# EAGLE schematic chargerboardrev2 (EAGLE 9.4.2)
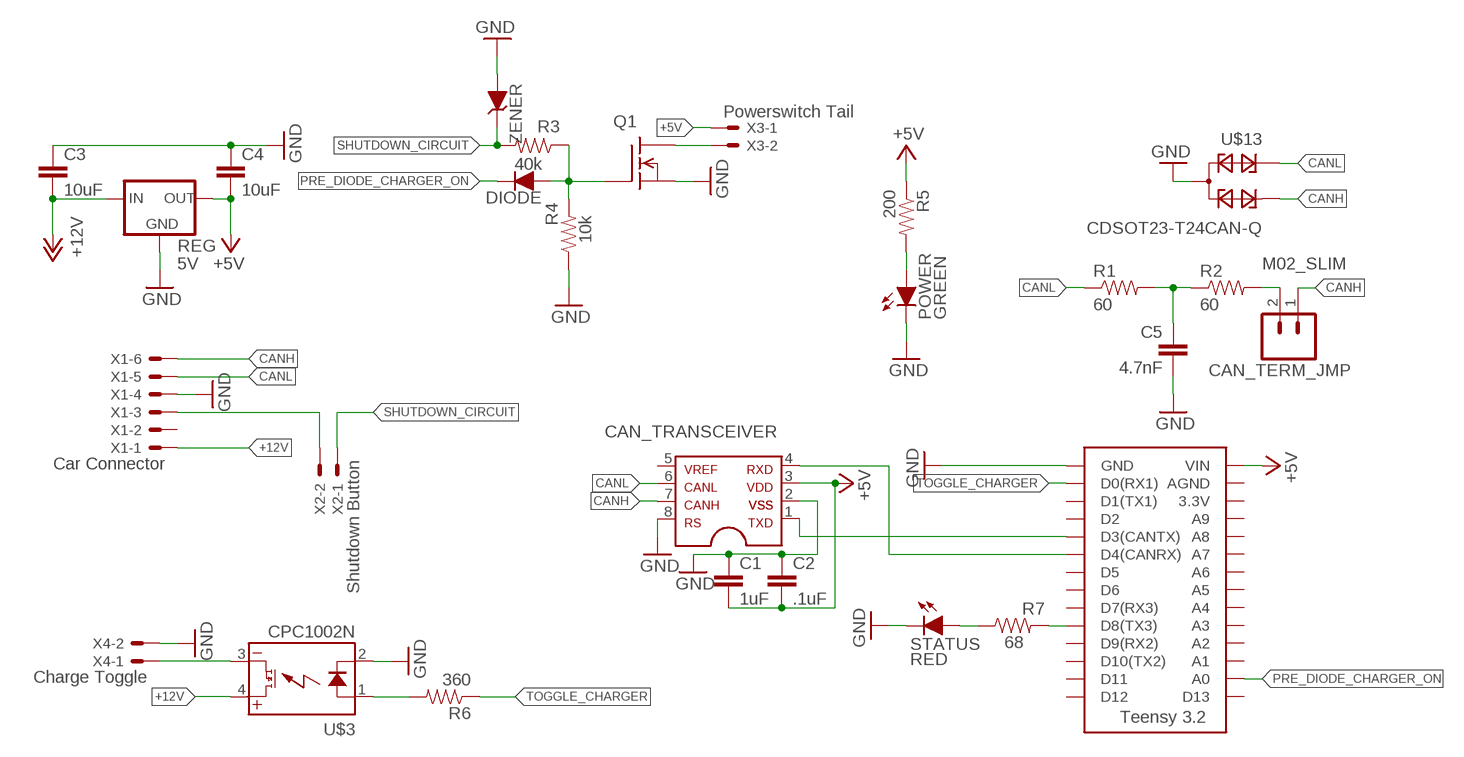
[diagram p0: schematic, sheet 1]

## Parts
C1  1uF  CAP0805  [0805]
C2  .1uF  CAP0805  [0805]
C3  10uF  CAP0805  [0805]
C4  10uF  CAP0805  [0805]
C5  4.7nF  CAP0805  [0805]
CAN_TERM_JMP  M02_SLIM  [1X02_SLIM]
CAN_TRANSCEIVER  MCP2551  [SOIC-08]
POWER  GREEN  LED-0805  [LED-805]
Q1  DMG3406LSOT  [SOT23]
R1  60  RESISTOR0805-RES  [0805]
R2  60  RESISTOR0805-RES  [0805]
R3  40k  RESISTOR0805-RES  [0805]
R4  10k  RESISTOR0805-RES  [0805]
R5  200  RESISTOR0805-RES  [0805]
R6  360  RESISTOR0805-RES  [0805]
R7  68  RESISTOR0805-RES  [0805]
REG  5V  OKI-78SR-5  [OKI-78SR]
STATUS  RED  LED-0805  [LED-805]
U$3  CPC1002N  [SOP04]
U$4  TEENSY_3.2_SIMPLE  [TEENSY_3.2_SIMPLE]
U$13  CDSOT23-T24CAN-Q  [SOT23]
X1  Car Connector  CONNECTOR-6NANO-FIT_VERTICAL-6  [NANO-FIT_VERTICAL-6]
X2  Shutdown Button  CONNECTOR-2  [MINIFIT_5566-2]
X3  Powerswitch Tail  CONNECTOR-2  [MINIFIT_5566-2]
X4  Charge Toggle  CONNECTOR-2  [MINIFIT_5566-2]
ZENER  DIODE_ZENER  [SOT23]
ZENER1  DIODE  DIODE0805  [0805_D]

## Nets
+5V: C1.2 C2.2 C4.2 CAN_TRANSCEIVER.3 R5.1 REG.3(OUT) U$4.VIN X3.1
+12V: C3.2 REG.1(IN) U$3.4(DC+) X1.P$1
CANH: CAN_TERM_JMP.1 CAN_TRANSCEIVER.7 U$13.2 X1.P$6
CANL: CAN_TRANSCEIVER.6 R1.1 U$13.1 X1.P$5
CHARGER_ON: Q1.1(G) R3.1 R4.2 ZENER1.A
GND: C1.1 C2.1 C3.1 C4.1 C5.2 CAN_TRANSCEIVER.2 CAN_TRANSCEIVER.8 POWER.C Q1.2(S) R4.1 REG.2(GND) STATUS.C U$3.2(CONTROL-) U$4.GND U$13.3 X1.P$4 X4.2 ZENER.1(A)
N$1: Q1.3(D) X3.2
N$7: U$3.3(DC-) X4.1
N$8: R7.1 STATUS.A
N$9: POWER.A R5.2
N$10: R6.2 U$3.1(CONTROL+)
N$11: R7.2 U$4.D8(TX3)
N$15: CAN_TRANSCEIVER.4 U$4.D4(CANRX)
N$17: CAN_TERM_JMP.2 R2.2
N$22: CAN_TRANSCEIVER.1 U$4.D3(CANTX)
N$62: C5.1 R1.2 R2.1
PRE_BRB_SHUTDOWN_CIRCUIT: X1.P$3 X2.2
PRE_DIODE_CHARGER_ON: U$4.A0 ZENER1.C
SHUTDOWN_CIRCUIT: R3.2 X2.1 ZENER.3(C)
TOGGLE_CHARGER: R6.1 U$4.D0(RX1)
Unconnected: CAN_TRANSCEIVER.5 U$4.3.3V U$4.A1 U$4.A2 U$4.A3 U$4.A4 U$4.A5 U$4.A6 U$4.A7 U$4.A8 U$4.A9 U$4.AGND U$4.D1(TX1) U$4.D2 U$4.D5 U$4.D6 U$4.D7(RX3) U$4.D9(RX2) U$4.D10(TX2) U$4.D11 U$4.D12 U$4.D13 X1.P$2

## Library data of the parts
C1-C5 = HyTechDevices:CAP: Capacitor Standard 0603 ceramic capacitor, and 0.1" leaded capacitor.
CAN_TERM_JMP = HyTechDevices:M02: Standard 2-pin 0.1" header. NOTES ON THE VARIANTS LOCK and LOCK_LONGPADS... This footprint was designed to help hold the alignment of a through-hole component (i.e. 6-pin header) while soldering it into place. You may notice that each hole has been shifted either up or down by 0.005 of an inch from it's more standard position (which is a perfectly straight line). This slight alteration caused the pins (the squares in the middle) to touch the edges of the holes. Because they are alternating, it causes a "brace" to hold the component in place. 0.005 has proven to be the perfect amount of "off-center" position when using our standard breakaway headers. Although looks a little odd when you look at the bare footprint, once you have a header in there, the alteration is very hard to notice. Also,if you push a header all the way into place, it is covered up entirely on the bottom side. This idea of altering the position of holes to aid alignment will be further integrated into the Sparkfun Library for other footprints. It can help hold any component with 3 or more connection pins. Note: The Sparkfun version includes many other packages including surface mount that may be of future interest. Source: Sparkfun <https://github.com/sparkfun/SparkFun-Eagle-Libraries>
CAN_TRANSCEIVER = HyTechDevices:MCP2551: MCP2551 High-Speed CAN Transceiver Product Webpage <https://www.microchip.com/wwwproducts/en/MCP2551> Datasheet <http://ww1.microchip.com/downloads/en/DeviceDoc/21667f.pdf> This device is outdated It is replaced by MCP2561. Comparison Page <https://www.microchip.com/wwwproducts/ProductCompare/MCP2551/MCP2561> Product Webpage <https://www.microchip.com/wwwproducts/en/MCP2561> Datasheet <http://ww1.microchip.com/downloads/en/DeviceDoc/20005167C.pdf>
POWER STATUS = HyTechDevices:LED: Light Emitting Diode (LED) Source: Dangerous Prototypes Eagle Library <https://github.com/DangerousPrototypes/Eagle_Part_Library>
Q1 = HyTechDevices:DMG3406L: Generic NPN MOSFET DMG3406L (SOT-23, 2.8 A 30V)
R1-R7 = HyTechDevices:RESISTOR: Resistor Basic schematic elements and footprints for 0603, 1206, and PTH resistors.
REG = HyTechDevices:OKI-78SR-5: Murata OKI-78SR 5V 1.5A Non-Isolated Switching Regulator DC/DC - Datasheet <https://power.murata.com/data/power/oki-78sr.pdf>
U$3 = HyTechDevices:CPC1002N: IXYS Solid State Relay .7A
U$4 = HyTechDevices:TEENSY_3.2_SIMPLE: Simple version of the Teensy 3.2 board that only uses the 2 main rows of pins, not the inner pins or the pins opposite the usb port.
U$13 = HyTechDevices:CDSOT23-T24CAN-Q: CAN Bus dual TVS array for transceiver ESD and surge protection
X1 = HyTechDevices:CONNECTOR-6: Mini-Fit Junior connector 6 pole Source: http://www.molex.com
X2-X4 = HyTechDevices:CONNECTOR-2: Mini-Fit Junior connector 2 pole Source: http://www.molex.com; OC_FARNELL: 1822072; OC_NEWARK: unknown
ZENER = HyTechDevices:DIODE_ZENER: ZENER DIODE
ZENER1 = HyTechDevices:DIODE: DIODE general purpose rectifier